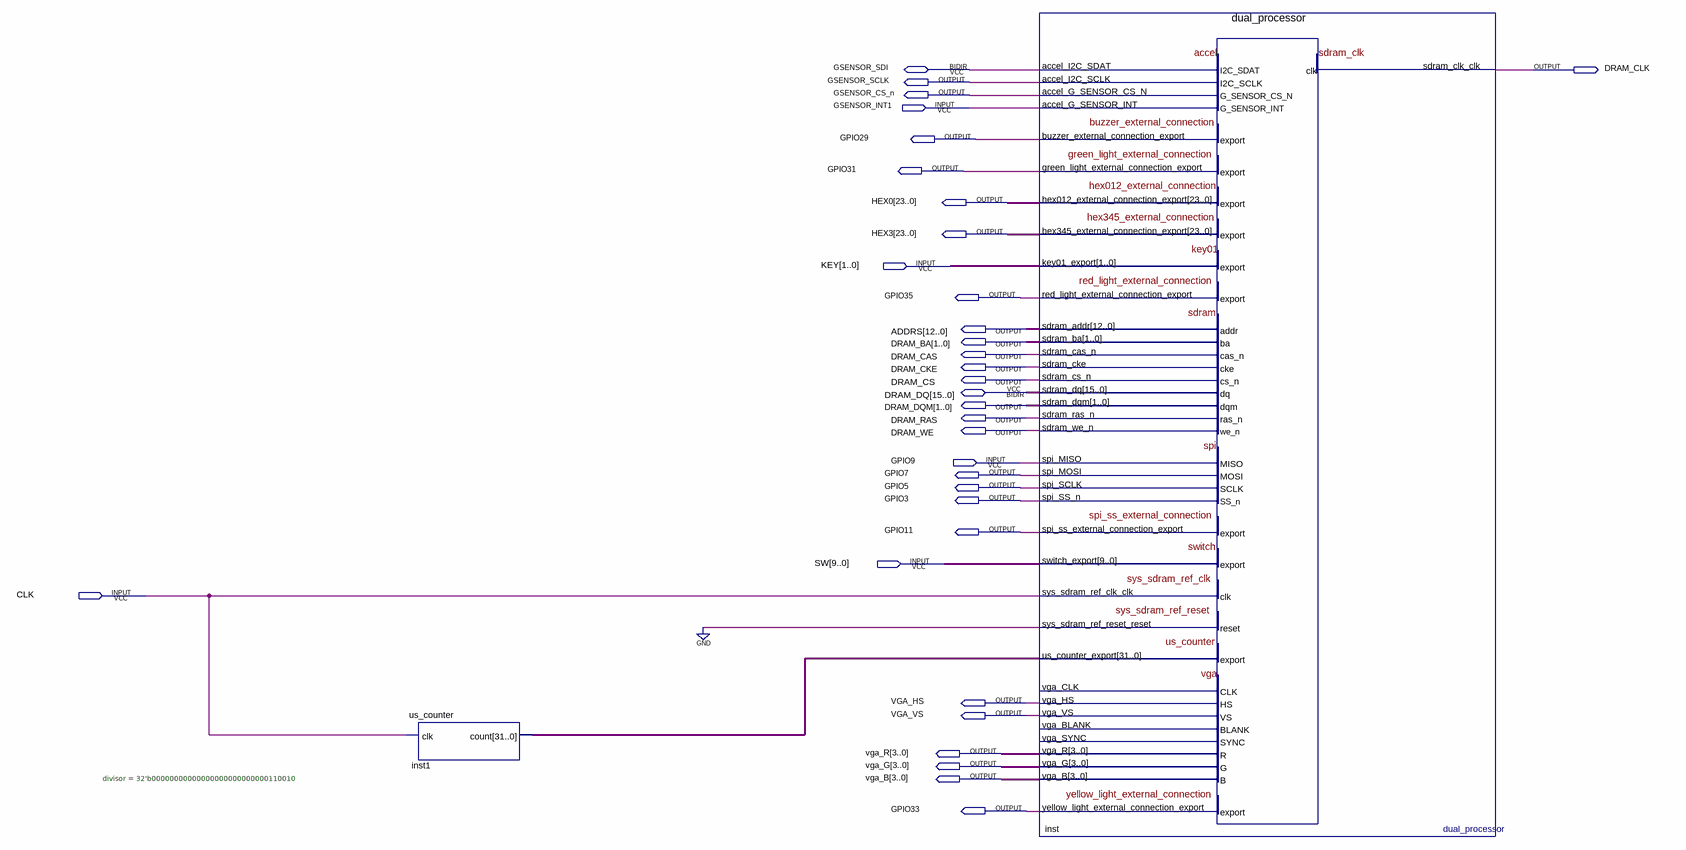
[diagram p0: schematic sheet]
// Quartus schematic ece3073_lab6V2.bdf as structural Verilog: 2 symbols, 33 pins
module ece3073_lab6V2 (
  input  GSENSOR_INT1,
  input  [1:0] KEY,
  input  GPIO9,
  input  [9:0] SW,
  input  CLK,
  inout  GSENSOR_SDI,
  inout  [15:0] DRAM_DQ,
  output DRAM_CLK,
  output GSENSOR_SCLK,
  output GSENSOR_CS_n,
  output GPIO29,
  output GPIO31,
  output [23:0] HEX0,
  output [23:0] HEX3,
  output GPIO35,
  output [12:0] ADDRS,
  output [1:0] DRAM_BA,
  output DRAM_CAS,
  output DRAM_CKE,
  output DRAM_CS,
  output [1:0] DRAM_DQM,
  output DRAM_RAS,
  output DRAM_WE,
  output GPIO7,
  output GPIO5,
  output GPIO3,
  output GPIO11,
  output VGA_HS,
  output VGA_VS,
  output [3:0] vga_R,
  output [3:0] vga_G,
  output [3:0] vga_B,
  output GPIO33
);

  wire [31:0] inst1_count;

  us_counter #(.divisor(32'b00000000000000000000000000110010)) inst1 (.clk(CLK), .count(inst1_count));
  dual_processor inst (
    .accel_G_SENSOR_INT(GSENSOR_INT1), .key01_export(KEY), .spi_MISO(GPIO9), .switch_export(SW),
    .sys_sdram_ref_clk_clk(CLK), .sys_sdram_ref_reset_reset(1'b0), .us_counter_export(inst1_count),
    .accel_I2C_SCLK(GSENSOR_SCLK), .accel_G_SENSOR_CS_N(GSENSOR_CS_n),
    .buzzer_external_connection_export(GPIO29), .green_light_external_connection_export(GPIO31),
    .hex012_external_connection_export(HEX0), .hex345_external_connection_export(HEX3),
    .red_light_external_connection_export(GPIO35), .sdram_addr(ADDRS), .sdram_ba(DRAM_BA),
    .sdram_cas_n(DRAM_CAS), .sdram_cke(DRAM_CKE), .sdram_cs_n(DRAM_CS), .sdram_dqm(DRAM_DQM),
    .sdram_ras_n(DRAM_RAS), .sdram_we_n(DRAM_WE), .sdram_clk_clk(DRAM_CLK), .spi_MOSI(GPIO7),
    .spi_SCLK(GPIO5), .spi_SS_n(GPIO3), .spi_ss_external_connection_export(GPIO11), .vga_HS(VGA_HS),
    .vga_VS(VGA_VS), .vga_R(vga_R), .vga_G(vga_G), .vga_B(vga_B),
    .yellow_light_external_connection_export(GPIO33), .accel_I2C_SDAT(GSENSOR_SDI), .sdram_dq(DRAM_DQ));  // open: vga_CLK, vga_BLANK, vga_SYNC
endmodule
